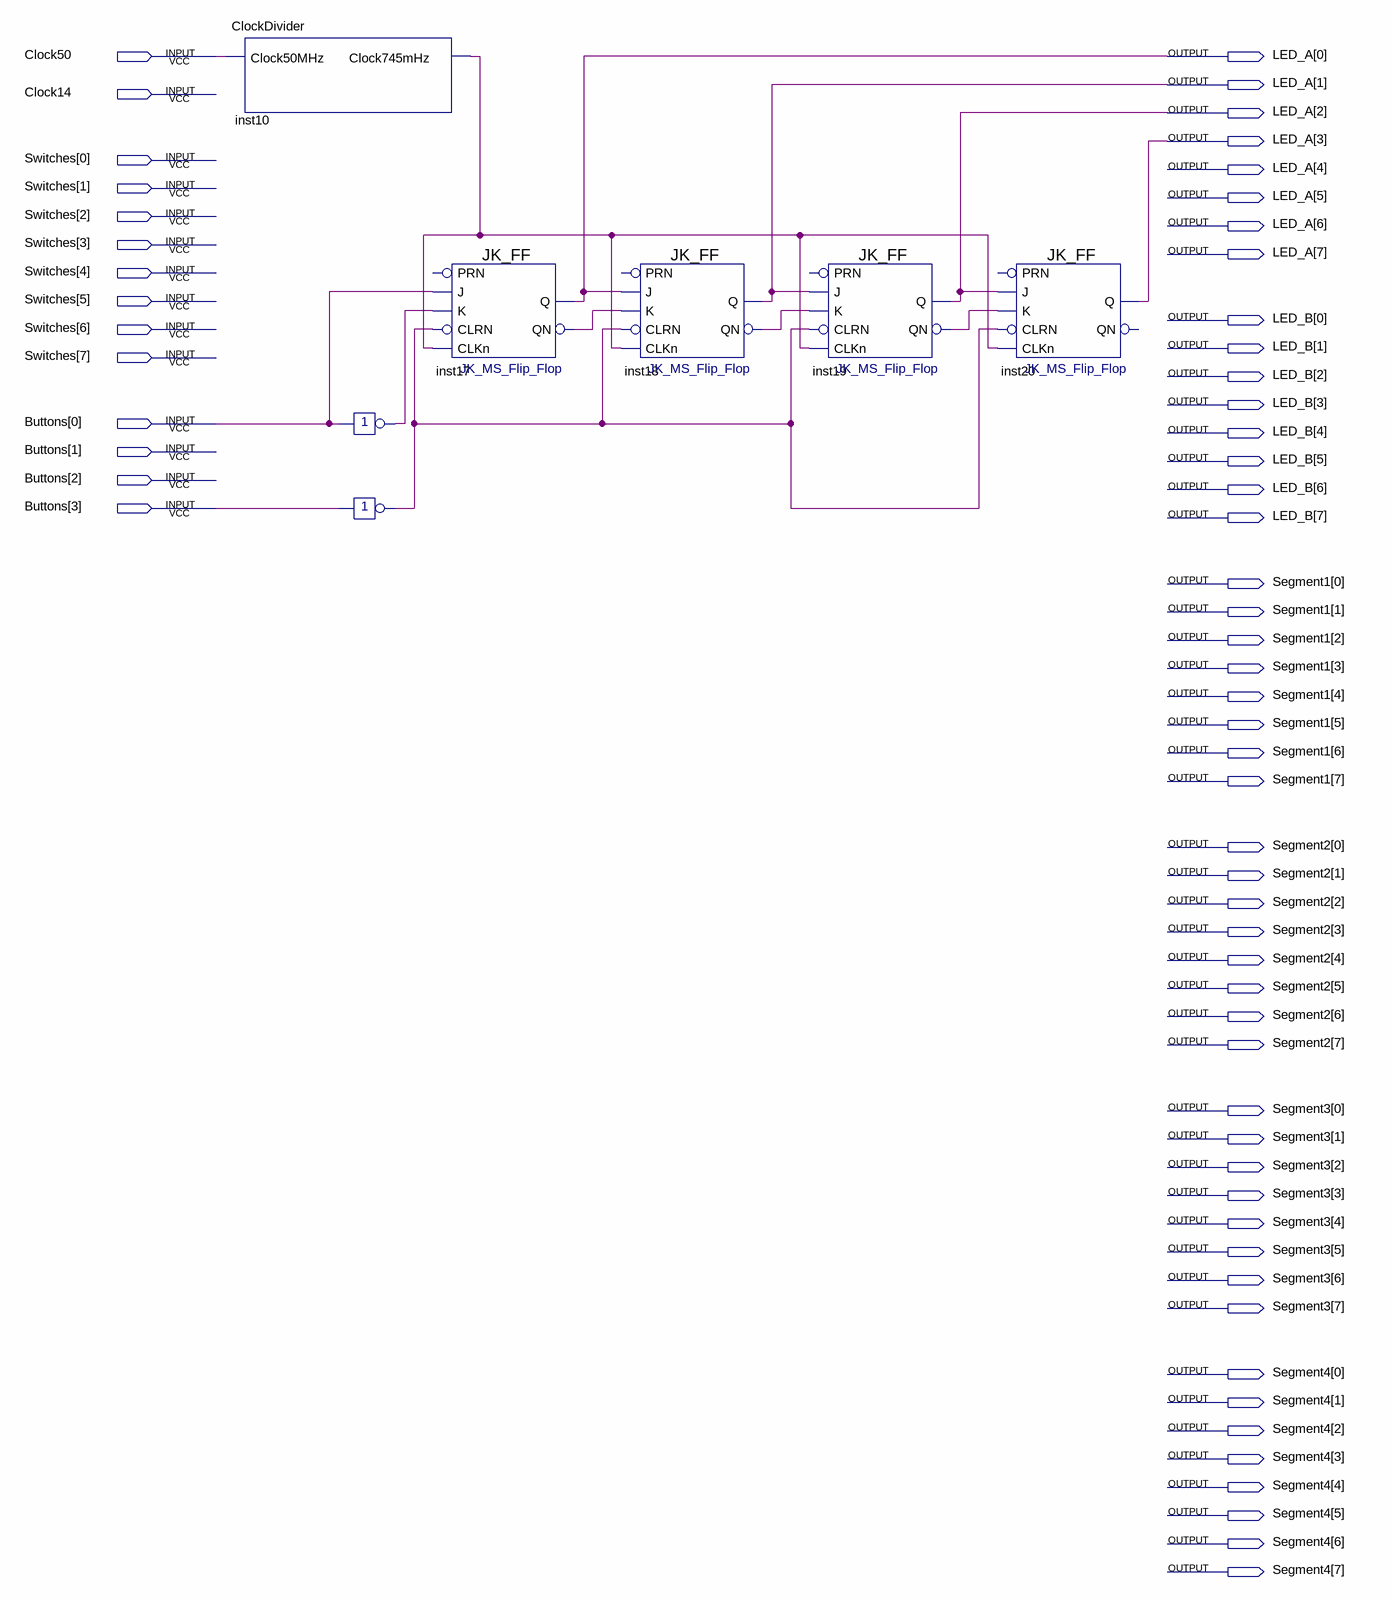
[diagram p0: schematic sheet]
// Quartus schematic Schieberegister.bdf as structural Verilog: 7 symbols, 62 pins
module Schieberegister (
  input  Clock50,
  input  Clock14,
  input  [7:0] Switches,
  input  [3:0] Buttons,
  output [7:0] LED_A,
  output [7:0] LED_B,
  output [7:0] Segment1,
  output [7:0] Segment2,
  output [7:0] Segment3,
  output [7:0] Segment4
);

  wire inst10_clock745mhz, inst12_out, inst13_out, inst17_qn, inst18_qn, inst19_qn;

  ClockDivider inst10 (.Clock50MHz(Clock50), .Clock745mHz(inst10_clock745mhz));
  not inst12 (inst12_out, Buttons[0]);
  not inst13 (inst13_out, Buttons[3]);
  JK_FF inst17 (
    .K(inst12_out), .J(Buttons[0]), .CLRN(inst13_out), .CLKn(inst10_clock745mhz), .QN(inst17_qn), .Q(LED_A[0]));  // open: PRN
  JK_FF inst18 (
    .K(inst17_qn), .J(LED_A[0]), .CLRN(inst13_out), .CLKn(inst10_clock745mhz), .QN(inst18_qn), .Q(LED_A[1]));  // open: PRN
  JK_FF inst19 (
    .K(inst18_qn), .J(LED_A[1]), .CLRN(inst13_out), .CLKn(inst10_clock745mhz), .QN(inst19_qn), .Q(LED_A[2]));  // open: PRN
  JK_FF inst20 (
    .K(inst19_qn), .J(LED_A[2]), .CLRN(inst13_out), .CLKn(inst10_clock745mhz), .Q(LED_A[3]));  // open: PRN, QN
endmodule
